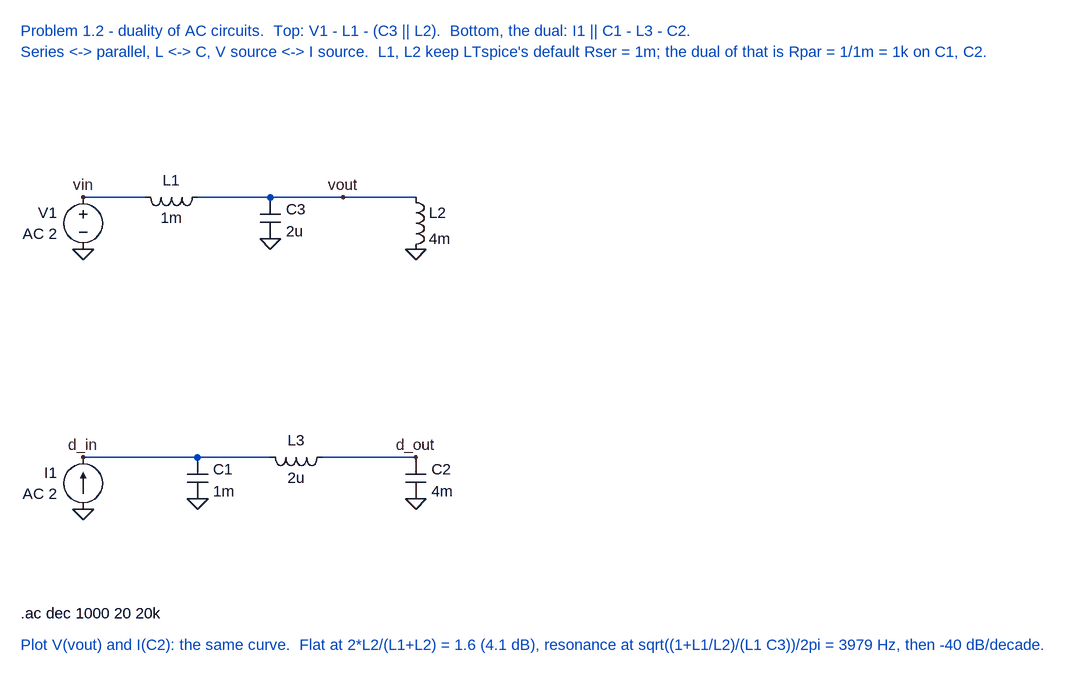
[diagram p0: schematic P1_2_AC_Duality.asc]
P1_2_AC_Duality.asc, the LTspice schematic file:
Version 4
SHEET 1 3000 1600
WIRE 0 0 96 0
WIRE 176 0 512 0
WIRE 0 400 288 400
WIRE 368 400 512 400
FLAG 0 80 0
FLAG 0 0 vin
FLAG 400 0 vout
FLAG 288 64 0
FLAG 512 80 0
FLAG 0 480 0
FLAG 0 400 d_in
FLAG 176 464 0
FLAG 512 400 d_out
FLAG 512 464 0
SYMBOL voltage 0 -16 R0
WINDOW 0 -40 40 Right 2
WINDOW 3 -40 72 Right 2
SYMATTR InstName V1
SYMATTR Value AC 2
SYMBOL ind 192 -16 R90
WINDOW 0 5 56 VBottom 2
WINDOW 3 32 56 VTop 2
SYMATTR InstName L1
SYMATTR Value 1m
SYMATTR SpiceLine Rser=1m
SYMBOL cap 272 0 R0
WINDOW 0 40 18 Left 2
WINDOW 3 40 52 Left 2
SYMATTR InstName C3
SYMATTR Value 2u
SYMBOL ind 496 -16 R0
SYMATTR InstName L2
SYMATTR Value 4m
SYMATTR SpiceLine Rser=1m
SYMBOL current 0 480 R180
WINDOW 0 40 56 Left 2
WINDOW 3 40 24 Left 2
SYMATTR InstName I1
SYMATTR Value AC 2
SYMBOL cap 160 400 R0
WINDOW 0 40 18 Left 2
WINDOW 3 40 52 Left 2
SYMATTR InstName C1
SYMATTR Value 1m
SYMATTR SpiceLine Rpar=1k
SYMBOL ind 384 384 R90
WINDOW 0 5 56 VBottom 2
WINDOW 3 32 56 VTop 2
SYMATTR InstName L3
SYMATTR Value 2u
SYMATTR SpiceLine Rser=0
SYMBOL cap 496 400 R0
WINDOW 0 40 18 Left 2
WINDOW 3 40 52 Left 2
SYMATTR InstName C2
SYMATTR Value 4m
SYMATTR SpiceLine Rpar=1k
TEXT -96 -256 Left 2 ;Problem 1.2 - duality of AC circuits.  Top: V1 - L1 - (C3 || L2).  Bottom, the dual: I1 || C1 - L3 - C2.
TEXT -96 -224 Left 2 ;Series <-> parallel, L <-> C, V source <-> I source.  L1, L2 keep LTspice's default Rser = 1m; the dual of that is Rpar = 1/1m = 1k on C1, C2.
TEXT -96 640 Left 2 !.ac dec 1000 20 20k
TEXT -96 688 Left 2 ;Plot V(vout) and I(C2): the same curve.  Flat at 2*L2/(L1+L2) = 1.6 (4.1 dB), resonance at sqrt((1+L1/L2)/(L1 C3))/2pi = 3979 Hz, then -40 dB/decade.

The netlist it stands for:
* P1_2_AC_Duality.asc
V1 vin 0 AC 2
L1 vout vin 1m Rser=1m
C3 vout 0 2u
L2 vout 0 4m Rser=1m
I1 0 d_in AC 2
C1 d_in 0 1m Rpar=1k
L3 d_out d_in 2u Rser=0
C2 d_out 0 4m Rpar=1k
* Problem 1.2 - duality of AC circuits.  Top: V1 - L1 - (C3 || L2).  Bottom, the dual: I1 || C1 - L3 - C2.
* Series <-> parallel, L <-> C, V source <-> I source.  L1, L2 keep LTspice's default Rser = 1m; the dual of that is Rpar = 1/1m = 1k on C1, C2.
.ac dec 1000 20 20k
* Plot V(vout) and I(C2): the same curve.  Flat at 2*L2/(L1+L2) = 1.6 (4.1 dB), resonance at sqrt((1+L1/L2)/(L1 C3))/2pi = 3979 Hz, then -40 dB/decade.
.backanno
.end